# EasyEDA schematic SCH_Business-card-no-mcu_2025-04-14.json
TITLE: Business card; REV: 1.0; Date: 2024-09-04; Sheet: 1/1; Drawn By: mmkf; Company: Your Company
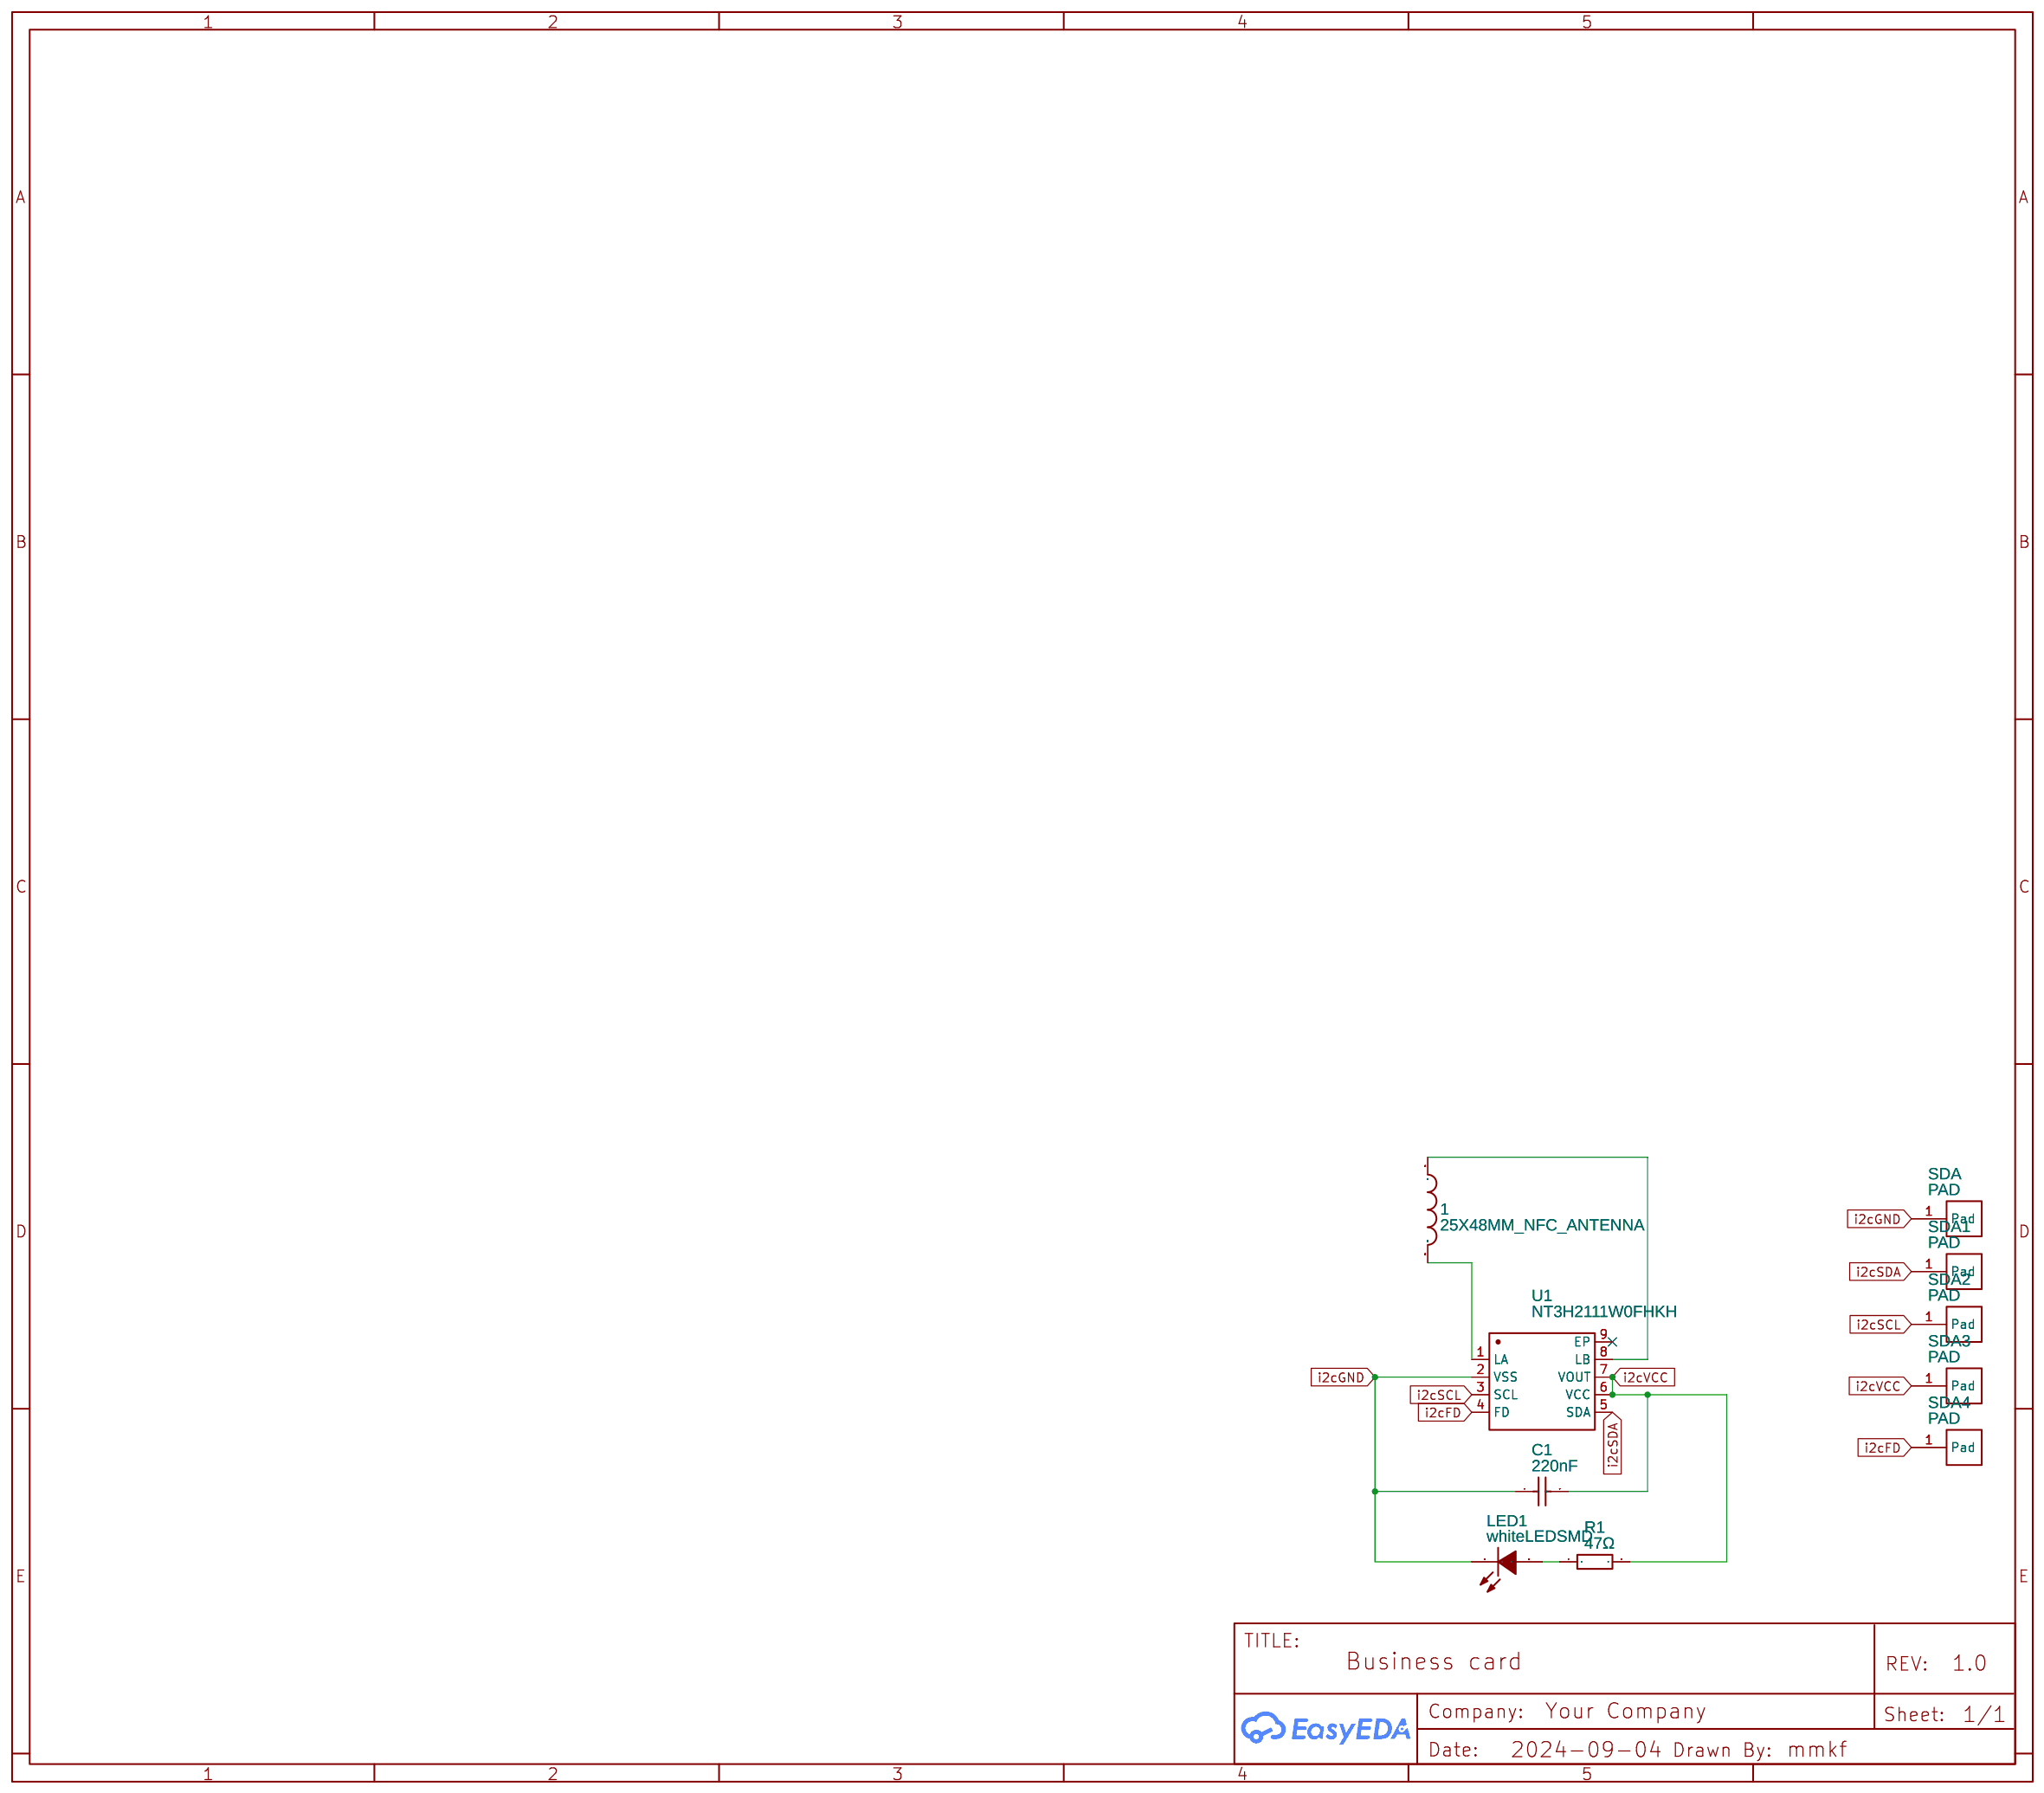
[diagram p0: schematic sheet]

## Parts
1  25X48MM_NFC_ANTENNA  [25X48MM_NFC_ANTENNA]
C1  220nF  [C0603]
LED1  whiteLEDSMD  [LED0805-R-RD]
R1  47Ω  [R0603]
SDA  PAD  [PADPAD]
SDA1  PAD  [PADPAD]
SDA2  PAD  [PADPAD]
SDA3  PAD  [PADPAD]
SDA4  PAD  [PADPAD]
U1  NT3H2111W0FHKH  [XQFN-8_L1.6-W1.6-P0.50-BL]

## Library data of the parts
1 = 25X48MM_NFC_ANTENNA: Contributor: Thomas Davies
C1 = CL10B224KA8NNNC: Supplier: LCSC; Manufacturer: SAMSUNG(三星); Supplier Part: C21120; JLCPCB Part Class: Basic Part
LED1 = whiteLEDSMD: Supplier: LCSC; Manufacturer: KENTO; Manufacturer Part: KT-0805W; Supplier Part: C34499; JLCPCB Part Class: Basic Part
R1 = 0603WAF470JT5E: Supplier: LCSC; Manufacturer: UNI-ROYAL(厚声); Supplier Part: C23182; JLCPCB Part Class: Basic Part
SDA SDA1-SDA4 = PAD: Contributor: HeinrichsEngineering
U1 = NT3H2111W0FHKH: Contributor: LCSC; Supplier: LCSC; Supplier Part: C710403; Manufacturer: NXP(恩智浦); JLCPCB Part Class: Extended Part

## Nets
i2cFD: SDA4.1(Pad) U1.4(FD)
i2cGND: C1.1 LED1.2(K) SDA.1(Pad) U1.2(VSS)
i2cSCL: SDA2.1(Pad) U1.3(SCL)
i2cSDA: SDA1.1(Pad) U1.5(SDA)
i2cVCC: C1.2 R1.2 SDA3.1(Pad) U1.6(VCC) U1.7(VOUT)
Net-(1-P$1): 1.P$1 U1.8(LB)
Net-(1-P$2): 1.P$2 U1.1(LA)
Net-(LED1-1): LED1.1(A) R1.1

Not connected (* = marked no-connect by the designer): U1 9(EP)*
